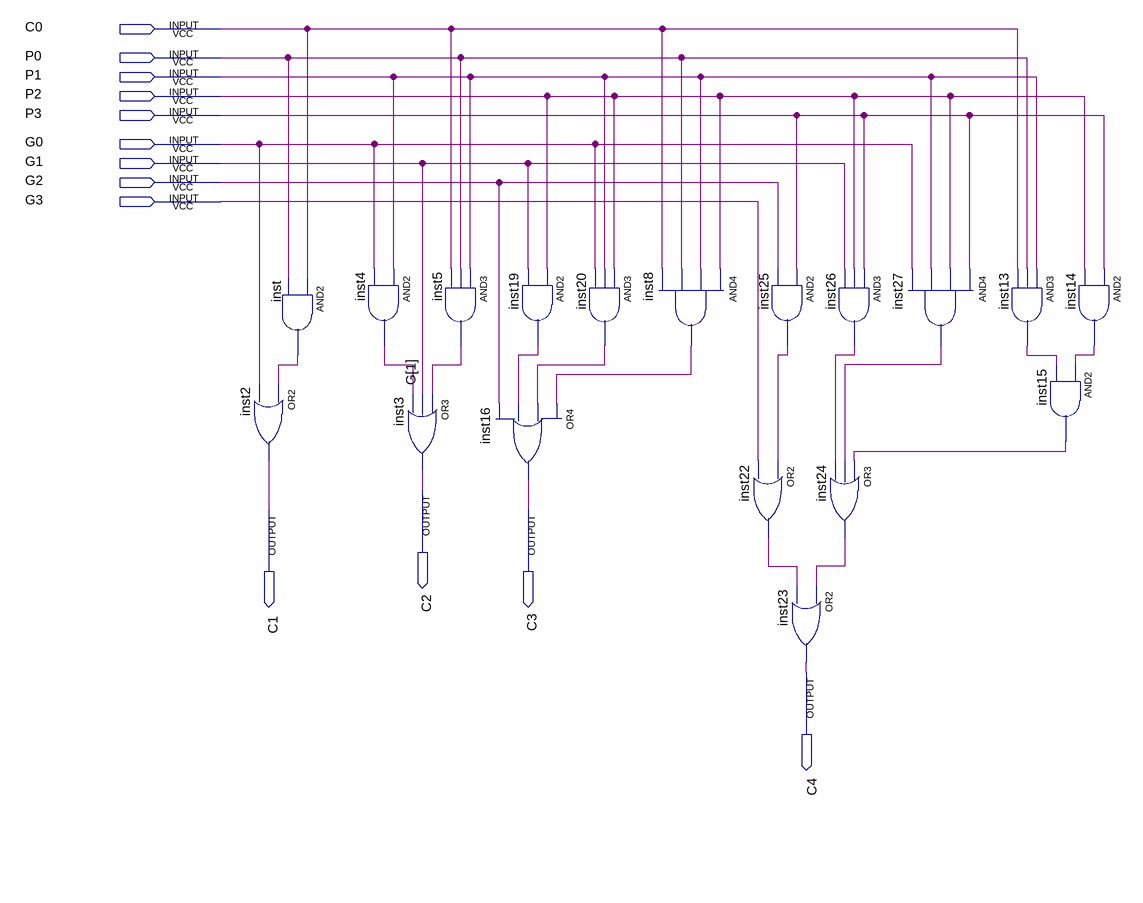
[diagram p0: schematic sheet]
// Quartus schematic clalogic.bdf as structural Verilog: 18 symbols, 13 pins
module clalogic (
  input  C0,
  input  P0,
  input  P1,
  input  P2,
  input  P3,
  input  G0,
  input  G1,
  input  G2,
  input  G3,
  output C2,
  output C1,
  output C3,
  output C4
);

  wire inst4_out, inst5_out, inst8_out, inst13_out, inst14_out, inst15_out, inst19_out, inst20_out,
       inst22_out, inst24_out, inst25_out, inst26_out, inst27_out, inst_out;

  or inst2 (C1, inst_out, G0);
  and inst (inst_out, C0, P0);
  and inst4 (inst4_out, P1, G0);
  or inst3 (C2, inst5_out, G1, inst4_out);
  and inst5 (inst5_out, P1, P0, C0);
  or inst16 (C3, inst8_out, inst20_out, inst19_out, G2);
  and inst19 (inst19_out, P2, G1);
  and inst20 (inst20_out, P2, P1, G0);
  and inst8 (inst8_out, P2, P1, P0, C0);
  and inst25 (inst25_out, P3, G2);
  or inst22 (inst22_out, inst25_out, G3);
  or inst23 (C4, inst24_out, inst22_out);
  and inst26 (inst26_out, P3, P2, G1);
  or inst24 (inst24_out, inst15_out, inst27_out, inst26_out);
  and inst27 (inst27_out, P3, P2, P1, G0);
  and inst13 (inst13_out, P1, P0, C0);
  and inst14 (inst14_out, P3, P2);
  and inst15 (inst15_out, inst14_out, inst13_out);
endmodule
